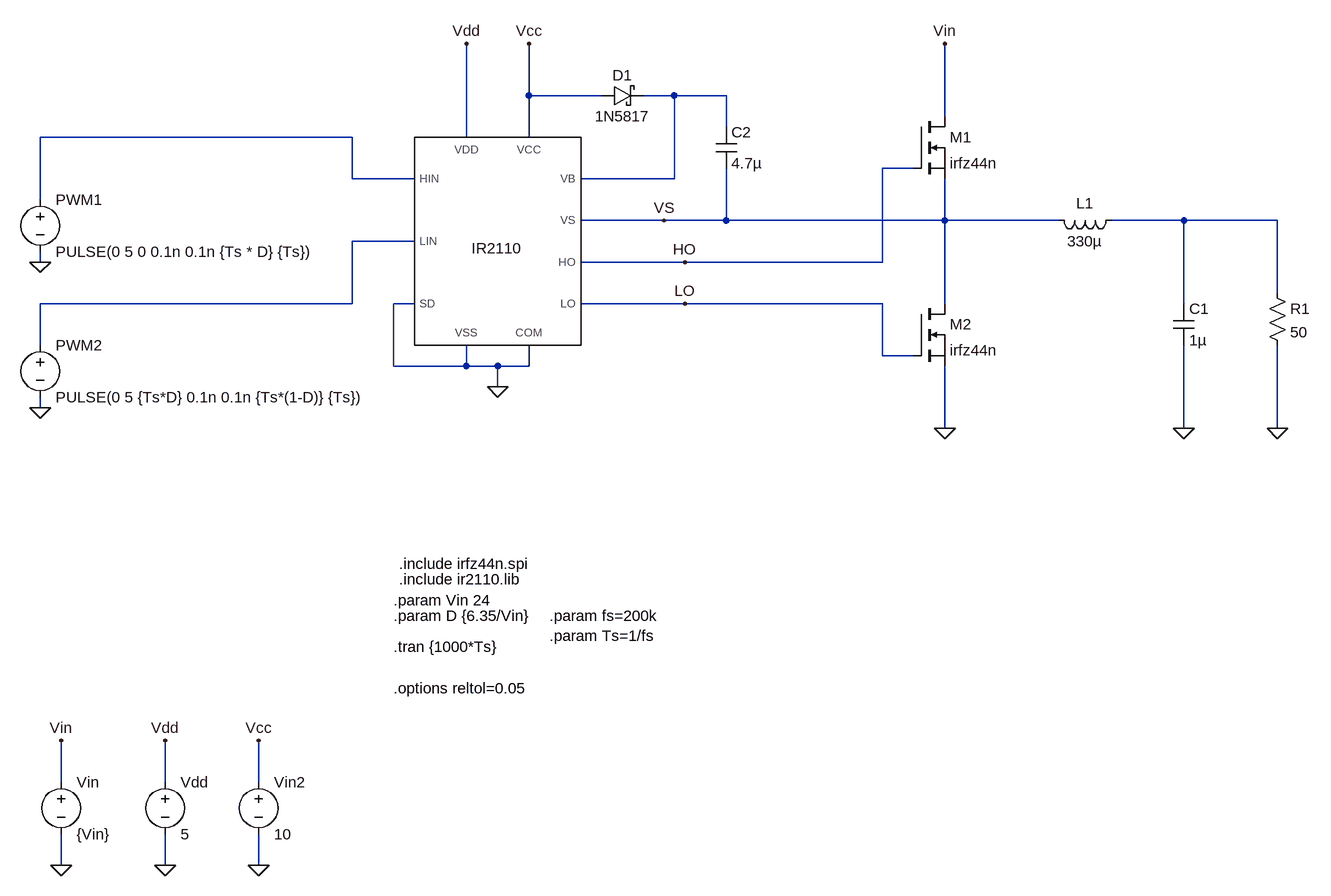
[diagram p0: schematic 04_11_04_buck_con_gate_driver.asc]
04_11_04_buck_con_gate_driver.asc, the LTspice schematic file:
Version 4
SHEET 1 1256 1540
WIRE -672 0 -672 -80
WIRE -560 0 -672 0
WIRE -448 0 -496 0
WIRE -368 0 -448 0
WIRE -32 32 -32 -80
WIRE -368 48 -368 0
WIRE -944 64 -1424 64
WIRE -768 64 -768 -80
WIRE -672 64 -672 0
WIRE -80 112 -128 112
WIRE -944 128 -944 64
WIRE -848 128 -944 128
WIRE -448 128 -448 0
WIRE -448 128 -592 128
WIRE -1424 160 -1424 64
WIRE -464 192 -592 192
WIRE -368 192 -368 112
WIRE -368 192 -464 192
WIRE -32 192 -32 128
WIRE -32 192 -368 192
WIRE 144 192 -32 192
WIRE 336 192 224 192
WIRE 480 192 336 192
WIRE -848 224 -944 224
WIRE -1424 256 -1424 240
WIRE -432 256 -592 256
WIRE -128 256 -128 112
WIRE -128 256 -432 256
WIRE 480 304 480 192
WIRE -944 320 -944 224
WIRE -944 320 -1424 320
WIRE -848 320 -880 320
WIRE -432 320 -592 320
WIRE -128 320 -432 320
WIRE -32 320 -32 192
WIRE 336 320 336 192
WIRE -1424 384 -1424 320
WIRE -128 400 -128 320
WIRE -80 400 -128 400
WIRE -880 416 -880 320
WIRE -768 416 -768 384
WIRE -768 416 -880 416
WIRE -720 416 -768 416
WIRE -672 416 -672 384
WIRE -672 416 -720 416
WIRE -720 448 -720 416
WIRE -1424 480 -1424 464
WIRE -32 512 -32 416
WIRE 336 512 336 384
WIRE 480 512 480 384
WIRE -1392 1056 -1392 992
WIRE -1232 1056 -1232 992
WIRE -1088 1056 -1088 992
WIRE -1392 1184 -1392 1136
WIRE -1232 1184 -1232 1136
WIRE -1088 1184 -1088 1136
FLAG 336 512 0
FLAG -1424 256 0
FLAG -1424 480 0
FLAG -1392 1184 0
FLAG 480 512 0
FLAG -720 448 0
FLAG -768 -80 Vdd
FLAG -672 -80 Vcc
FLAG -32 512 0
FLAG -32 -80 Vin
FLAG -1392 992 Vin
FLAG -1232 1184 0
FLAG -1232 992 Vdd
FLAG -1088 1184 0
FLAG -1088 992 Vcc
FLAG -432 320 LO
FLAG -432 256 HO
FLAG -464 192 VS
SYMBOL ind 240 176 R90
WINDOW 0 5 56 VBottom 2
WINDOW 3 32 56 VTop 2
SYMATTR InstName L1
SYMATTR Value 330µ
SYMBOL cap 320 320 R0
SYMATTR InstName C1
SYMATTR Value 1µ
SYMBOL voltage -1392 1040 R0
WINDOW 123 0 0 Left 0
WINDOW 39 0 0 Left 0
SYMATTR InstName Vin
SYMATTR Value {Vin}
SYMBOL voltage -1424 144 R0
WINDOW 123 0 0 Left 0
WINDOW 39 0 0 Left 0
SYMATTR InstName PWM1
SYMATTR Value PULSE(0 5 0 0.1n 0.1n {Ts * D} {Ts})
SYMBOL voltage -1424 368 R0
WINDOW 123 0 0 Left 0
WINDOW 39 0 0 Left 0
SYMATTR InstName PWM2
SYMATTR Value PULSE(0 5 {Ts*D} 0.1n 0.1n {Ts*(1-D)} {Ts})
SYMBOL res 464 288 R0
SYMATTR InstName R1
SYMATTR Value 50
SYMBOL nmos -80 32 R0
SYMATTR InstName M1
SYMATTR Value irfz44n
SYMBOL nmos -80 320 R0
SYMATTR InstName M2
SYMATTR Value irfz44n
SYMBOL ir2110 -784 176 R0
WINDOW 0 0 0 Invisible 0
WINDOW 3 63 43 Top 2
SYMATTR InstName X1
SYMATTR SpiceModel ir2110
SYMBOL voltage -1232 1040 R0
WINDOW 123 0 0 Left 0
WINDOW 39 0 0 Left 0
SYMATTR InstName Vdd
SYMATTR Value 5
SYMBOL voltage -1088 1040 R0
WINDOW 123 0 0 Left 0
WINDOW 39 0 0 Left 0
SYMATTR InstName Vin2
SYMATTR Value 10
SYMBOL schottky -560 16 R270
WINDOW 0 32 32 VTop 2
WINDOW 3 0 32 VBottom 2
SYMATTR InstName D1
SYMATTR Value 1N5817
SYMATTR Description Diode
SYMATTR Type diode
SYMBOL cap -384 48 R0
SYMATTR InstName C2
SYMATTR Value 4.7µ
TEXT -640 800 Left 2 !.param fs=200k\n.param Ts=1/fs
TEXT -880 800 Left 2 !.param D {6.35/Vin}
TEXT -880 776 Left 2 !.param Vin 24
TEXT -880 848 Left 2 !.tran {1000*Ts}
TEXT -872 720 Left 2 !.include irfz44n.spi
TEXT -872 744 Left 2 !.include ir2110.lib
TEXT -880 912 Left 2 !.options reltol=0.05

The netlist it stands for:
* 04_11_04_buck_con_gate_driver.asc
L1 N003 VS 330µ
C1 N003 0 1µ
Vin Vin 0 {Vin}
V§PWM1 N002 0 PULSE(0 5 0 0.1n 0.1n {Ts * D} {Ts})
V§PWM2 N004 0 PULSE(0 5 {Ts*D} 0.1n 0.1n {Ts*(1-D)} {Ts})
R1 N003 0 50
M1 Vin HO VS VS irfz44n
M2 VS LO 0 0 irfz44n
XX1 LO HO 0 0 N004 N002 Vcc N001 VS Vdd 0 ir2110 IR2110  ; pins LO HO COM VSS LIN HIN VCC VB VS VDD SD
Vdd Vdd 0 5
Vin2 Vcc 0 10
D1 Vcc N001 1N5817
C2 N001 VS 4.7µ
.model D D
.lib standard.dio
.model NMOS NMOS
.model PMOS PMOS
.lib standard.mos
.param fs=200k
.param Ts=1/fs
.param D {6.35/Vin}
.param Vin 24
.tran {1000*Ts}
.include irfz44n.spi
.include ir2110.lib
.options reltol=0.05
.lib IR2110.lib
.backanno
.end